# EAGLE schematic V4-AddOnESP8266-V01-001 (EAGLE 9.3.0)
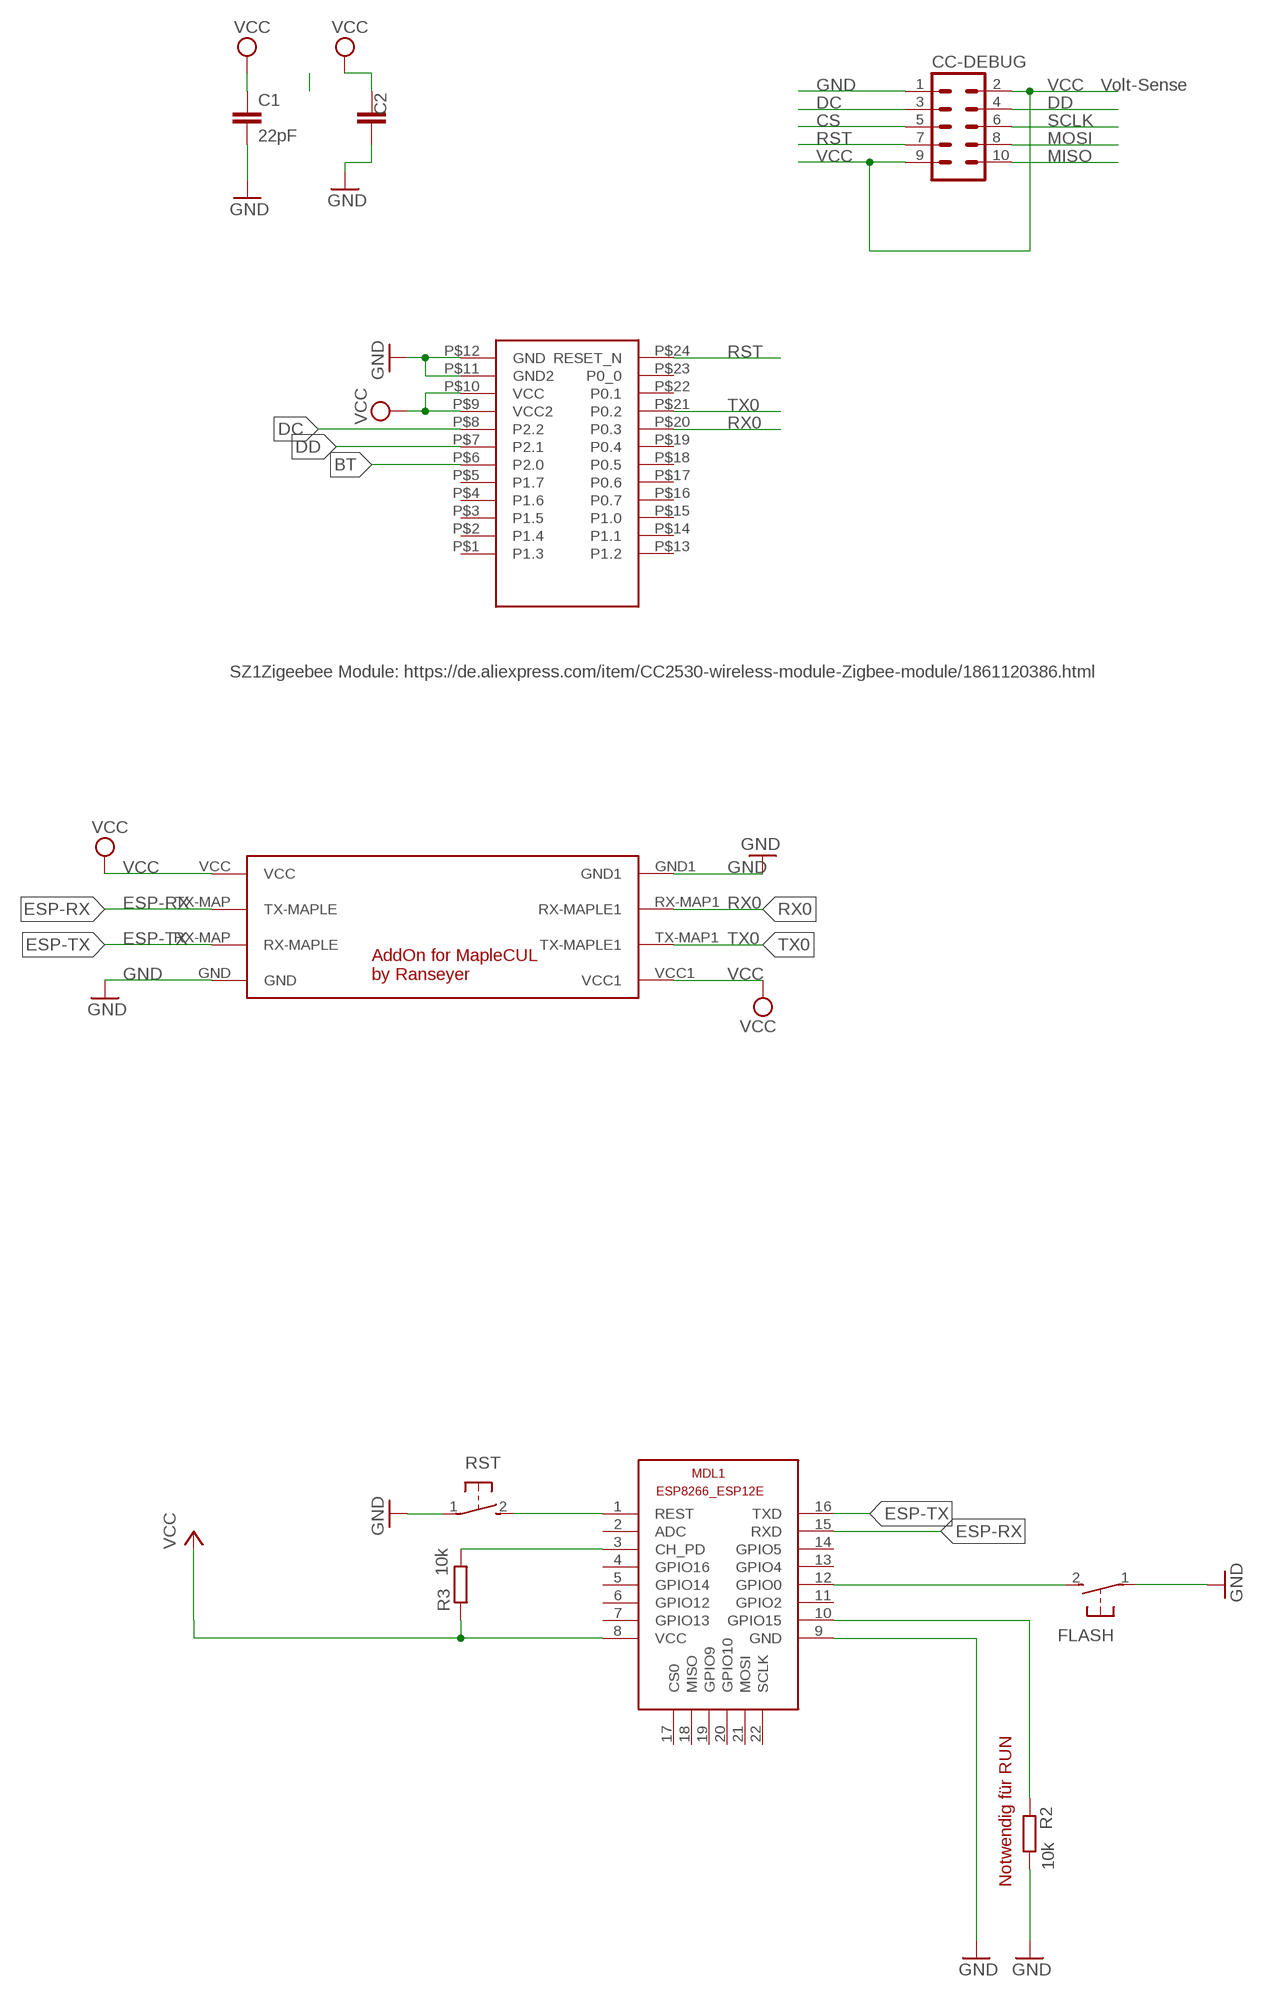
[diagram p0: schematic, sheet 1]

## Parts
C1  22pF  C-EUC0805  [C0805]
C2  C-EUC1812  [C1812]
CC-DEBUG  CONN_05X2SHD_LOCK  [2X5-SHROUDED_LOCK]
FLASH  DTSM-3  [DTSM-3]
MDL1  ESP8266-12EESP8266-ESP12E  [ESP8266-ESP12E]
R2  10k  R-EU_M1206  [M1206]
R3  10k  R-EU_M1206  [M1206]
RST  DTSM-3  [DTSM-3]
U$1  MAPLE-CUL-ADDON-V01  [MAPLE-CUL-V01]
U$2  CC2530  [SZ1ZIGBEE-SMD]

## Nets
BT: U$2.P$6(P2.0)
CS: CC-DEBUG.5
DC: CC-DEBUG.3 U$2.P$8(P2.2)
DD: CC-DEBUG.4 U$2.P$7(P2.1)
ESP-RX: MDL1.15(RXD) U$1.TX-MAP(TX-MAPLE)
ESP-TX: MDL1.16(TXD) U$1.RX-MAP(RX-MAPLE)
GND [PWR]: C1.2 C2.1 CC-DEBUG.1 FLASH.1 MDL1.9(GND) R2.2 RST.1 U$1.GND U$1.GND1 U$2.P$11(GND2) U$2.P$12(GND)
MISO: CC-DEBUG.10
MOSI: CC-DEBUG.8
N$2: MDL1.1(REST) RST.2
N$3: FLASH.2 MDL1.12(GPIO0)
N$7: MDL1.3(CH_PD) R3.2
N$19: MDL1.10(GPIO15) R2.1
RST: CC-DEBUG.7 U$2.P$24(RESET_N)
RX0: U$1.RX-MAP1(RX-MAPLE1) U$2.P$20(P0.3)
SCLK: CC-DEBUG.6
TX0: U$1.TX-MAP1(TX-MAPLE1) U$2.P$21(P0.2)
VCC [PWR]: C1.1 C2.2 CC-DEBUG.2 CC-DEBUG.9 MDL1.8(VCC) R3.1 U$1.VCC U$1.VCC1 U$2.P$9(VCC2) U$2.P$10(VCC)
Unconnected: MDL1.2(ADC) MDL1.4(GPIO16) MDL1.5(GPIO14) MDL1.6(GPIO12) MDL1.7(GPIO13) MDL1.11(GPIO2) MDL1.13(GPIO4) MDL1.14(GPIO5) MDL1.17(CS0) MDL1.18(MISO) MDL1.19(GPIO9) MDL1.20(GPIO10) MDL1.21(MOSI) MDL1.22(SCLK) U$2.P$1(P1.3) U$2.P$2(P1.4) U$2.P$3(P1.5) U$2.P$4(P1.6) U$2.P$5(P1.7) U$2.P$13(P1.2) U$2.P$14(P1.1) U$2.P$15(P1.0) U$2.P$16(P0.7) U$2.P$17(P0.6) U$2.P$18(P0.5) U$2.P$19(P0.4) U$2.P$22(P0.1) U$2.P$23(P0_0)

## Notes on the sheet
- Volt-Sense
- SZ1Zigeebee Module: https://de.aliexpress.com/item/CC2530-wireless-module-Zigbee-module/1861120386.html
- Notwendig für RUN

## Library data of the parts
C1 C2 = rcl:C-EU: CAPACITOR, European symbol; SPICEPREFIX: C
CC-DEBUG = SparkFun-Connectors:CONN_05X2: Multi connection point. Often used as Generic Header-pin footprint for 0.1 inch spaced/style header connections For AVR SPI programming port, see special device with nice symbol: "AVR_SPI_PROG_5x2.dev" You can populate with any combo of single row headers, but if you'd like an exact match, check these: 2x5 AVR ICSP Male Header <https://www.sparkfun.com/products/778> (PRT-00778) 2x5 Pin Shrouded Header <https://www.sparkfun.com/products/8506> (PRT-08506) On any of the 0.1 inch spaced packages, you can populate with these: Break Away Headers - Straight <https://www.sparkfun.com/products/116> (PRT-00116) Break Away Male Headers - Right Angle <https://www.sparkfun.com/products/553> (PRT-00553) Female Headers <https://www.sparkfun.com/products/115> (PRT-00115) Break Away Headers - Machine Pin <https://www.sparkfun.com/products/117> (PRT-00117) Break Away Female Headers - Swiss Machine Pin <https://www.sparkfun.com/products/743> (PRT-00743) Special note: the shrouded connector mates well with our 5x2 ribbon cables: 2x5 Pin IDC Ribbon Cable <https://www.sparkfun.com/products/8535> (PRT-08535); PROD_ID: CONN-08671; SF_ID: PRT-08506
FLASH RST = switch-tact:DTSM-3
MDL1 = ESP8266-ESP12E:ESP8266-12E: ESP8266-12E with additional I/O and GPIO04/05 corrected The author cannot warrant that this library is free from error or will meet your specific requirements. Created by PuceBaboon.com. Komagane, Nagano, JAPAN
R2 R3 = rcl:R-EU_: RESISTOR, European symbol
U$1 = Martin-Communication-V4:MAPLE-CUL-ADDON-V01: AddOn for MAPLE-CUL V4.x
U$2 = zigbee:CC2530: CC2530 Wireless Zigbee Module 3.0-3.6V 2.405-2.485GHz SMD Pads !

## Net classes
0 default: width 0.305 mm
1 PWR: width 0.406 mm